# Altium schematic sheet SLAVE.SchDoc
size A4; SheetNumber: 3; SheetTotal: 6
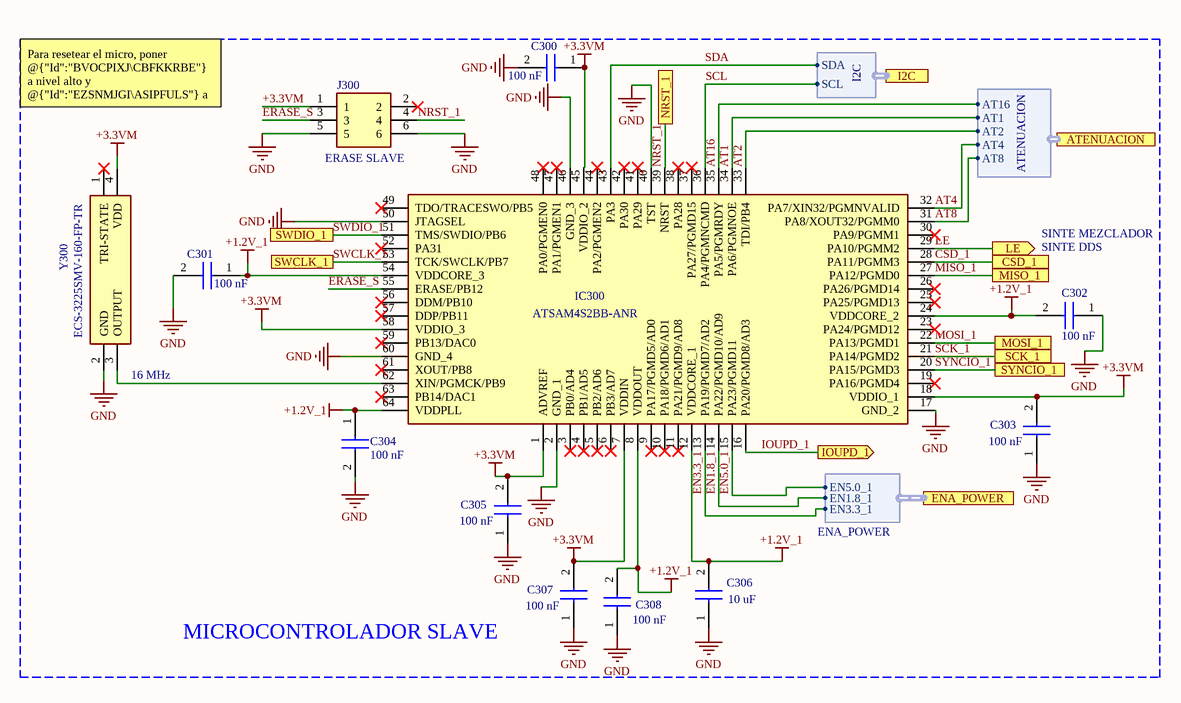
[diagram p0: SLAVE.SchDoc]

## Parts
C300  100 nF  [C0603]
C301  100 nF  [C0603]
C302  100 nF  [C0603]
C303  100 nF  [C0603]
C304  100 nF  [C0603]
C305  100 nF  [C0603]
C306  10 uF  [C0603]
C307  100 nF  [C0603]
C308  100 nF  [C0603]
IC300  ATSAM4S2BB-ANR  [QFN50P905X905X75-65N]
J300  ERASE SLAVE  [HDRV6W64P254_2X3_762X508X889P]
Y300  ECS-3225SMV-160-FP-TR  [ECS3225SMV160FPTR]

## Ports
ATENUACION (harness ATENUACION), CSD_1, ENA_POWER (harness ENA_POWER), I2C (harness I2C), IOUPD_1 (out), LE (out), MISO_1, MOSI_1, NRST_1, SCK_1, SWCLK_1, SWDIO_1, SYNCIO_1

## Harnesses
I2C: SDA, SCL
ATENUACION: AT16, AT1, AT2, AT4, AT8
ENA_POWER: EN5.0_1, EN1.8_1, EN3.3_1

## Nets
+1.2V_1: C301.1 C302.2 C304.1 C306.2 C308.2 IC300.8(VDDOUT) IC300.12(VDDCORE_1) IC300.24(VDDCORE_2) IC300.54(VDDCORE_3) IC300.64(VDDPLL)
+3.3VM: C300.1 C303.2 C305.2 C307.2 IC300.1(ADVREF) IC300.7(VDDIN) IC300.18(VDDIO_1) IC300.45(VDDIO_2) IC300.58(VDDIO_3) J300.1 Y300.4(VDD)
GND: C300.2 C301.2 C302.1 C303.1 C304.2 C305.1 C306.1 C307.1 C308.1 IC300.2(GND_1) IC300.17(GND_2) IC300.40(TST) IC300.46(GND_3) IC300.50(JTAGSEL) IC300.60(GND_4) J300.5 J300.6 Y300.2(GND)
AT1: IC300.34(PA6/PGMNOE) ; port ATENUACION.AT1
AT2: IC300.33(TDI/PB4) ; port ATENUACION.AT2
AT4: IC300.32(PA7/XIN32/PGMNVALID) ; port ATENUACION.AT4
AT8: IC300.31(PA8/XOUT32/PGMM0) ; port ATENUACION.AT8
AT16: IC300.35(PA5/PGMRDY) ; port ATENUACION.AT16
CSD_1: IC300.28(PA11/PGMM3) ; port CSD_1
EN1.8_1: IC300.14(PA22/PGMD10/AD9) ; port ENA_POWER.EN1.8_1
EN3.3_1: IC300.13(PA19/PGMD7/AD2) ; port ENA_POWER.EN3.3_1
EN5.0_1: IC300.15(PA23/PGMD11) ; port ENA_POWER.EN5.0_1
ERASE_S: IC300.55(ERASE/PB12) J300.3
IOUPD_1: IC300.16(PA20/PGMD8/AD3) ; port IOUPD_1
LE: IC300.29(PA10/PGMM2) ; port LE
MISO_1: IC300.27(PA12/PGMD0) ; port MISO_1
MOSI_1: IC300.22(PA13/PGMD1) ; port MOSI_1
NRST_1: IC300.39(NRST) J300.4 ; port NRST_1
SCK_1: IC300.21(PA14/PGMD2) ; port SCK_1
SCL: IC300.36(PA4/PGMNCMD) ; port I2C.SCL
SDA: IC300.43(PA3) ; port I2C.SDA
SWCLK_1: IC300.53(TCK/SWCLK/PB7) ; port SWCLK_1
SWDIO_1: IC300.51(TMS/SWDIO/PB6) ; port SWDIO_1
SYNCIO_1: IC300.20(PA15/PGMD3) ; port SYNCIO_1
NetIC300_62: IC300.62(XIN/PGMCK/PB9) Y300.3(OUTPUT)

Not connected (* = marked no-connect by the designer): IC300 3(PB0/AD4)* 4(PB1/AD5)* 5(PB2/AD6)* 6(PB3/AD7)* 9(PA17/PGMD5/AD0)* 10(PA18/PGMD6/AD1)* 11(PA21/PGMD9/AD8)* 19(PA16/PGMD4)* 23(PA24/PGMD12)* 25(PA25/PGMD13)* 26(PA26/PGMD14)* 30(PA9/PGMM1)* 37(PA27/PGMD15)* 38(PA28)* 41(PA29)* 42(PA30)* 44(PA2/PGMEN2)* 47(PA1/PGMEN1)* 48(PA0/PGMEN0)* 49(TDO/TRACESWO/PB5)* 52(PA31)* 56(DDM/PB10)* 57(DDP/PB11)* 59(PB13/DAC0)* 61(XOUT/PB8)* 63(PB14/DAC1)*; J300 2*; Y300 1(TRI-STATE)*

## Notes on the sheet
- Para resetear el micro, poner @{"Id":"BVOCPIXJ\CBFKKRBE"} a nivel alto y @{"Id":"EZSNMJGI\ASIPFULS"} a nivel bajo. En reposo, colocar @{"Id":"BVOCPIXJ\CBFKKRBE"} a nivel bajo y @{"Id":"EZSNMJGI\ASIPFULS"} en vacio.
- SINTE MEZCLADOR
- SINTE DDS
- (near Y300) 16 MHz
- MICROCONTROLADOR SLAVE

## Library data of the parts
C300-C308 = C0603H470J5GACTU: Capacitor; Manufacturer_Name: KEMET; Datasheet Link: https://content.kemet.com/datasheets/KEM_C1001_C0G_200C_SMD.pdf; Height: 0.87mm; Manufacturer_Part_Number: C0603H470J5GACTU
IC300 = ATSAM4S2BB-ANR: Integrated Circuit; Manufacturer_Name: Microchip; Datasheet Link: https://www.arrow.com/en/products/atsam4s2bb-anr/microchip-technology; Height: 1.6mm; Manufacturer_Part_Number: ATSAM4S2BB-ANR; Mouser Part Number: 556-ATSAM4S2BB-ANR; Mouser Price/Stock: https://www.mouser.co.uk/ProductDetail/Microchip-Technology/ATSAM4S2BB-ANR?qs=YCa%2FAAYMW01XwEtU%252BP2dsA%3D%3D; Arrow Part Number: ATSAM4S2BB-ANR; Arrow Price/Stock: https://www.arrow.com/en/products/atsam4s2bb-anr/microchip-technology
J300 = 61300621121: Connector; Manufacturer_Name: Wurth Elektronik; Height: 8.89mm; Manufacturer_Part_Number: 61300621121; Mouser Part Number: 710-61300621121; Mouser Price/Stock: https://www.mouser.co.uk/ProductDetail/Wurth-Elektronik/61300621121?qs=PhR8RmCirEb94hrEcn0AQg%3D%3D
Y300 = ECS-3225SMV-160-FP-TR: Crystal or Oscillator; Manufacturer_Name: ECS; Datasheet Link: https://datasheet.datasheetarchive.com/originals/distributors/Datasheets_SAMA/aca54b4a763fa6b74cd8d2921d99cf9f.pdf; Height: 1.2mm; Manufacturer_Part_Number: ECS-3225SMV-160-FP-TR; Mouser Part Number: 520-3225SMV-160-FPT; Mouser Price/Stock: https://www.mouser.co.uk/ProductDetail/ECS/ECS-3225SMV-160-FP-TR?qs=%252B6g0mu59x7IhPTRSFb%2Fsjg%3D%3D; Arrow Part Number: ECS-3225SMV-160-FP-TR; Arrow Price/Stock: https://www.arrow.com/en/products/ecs-3225smv-160-fp-tr/ecs-international?region=nac